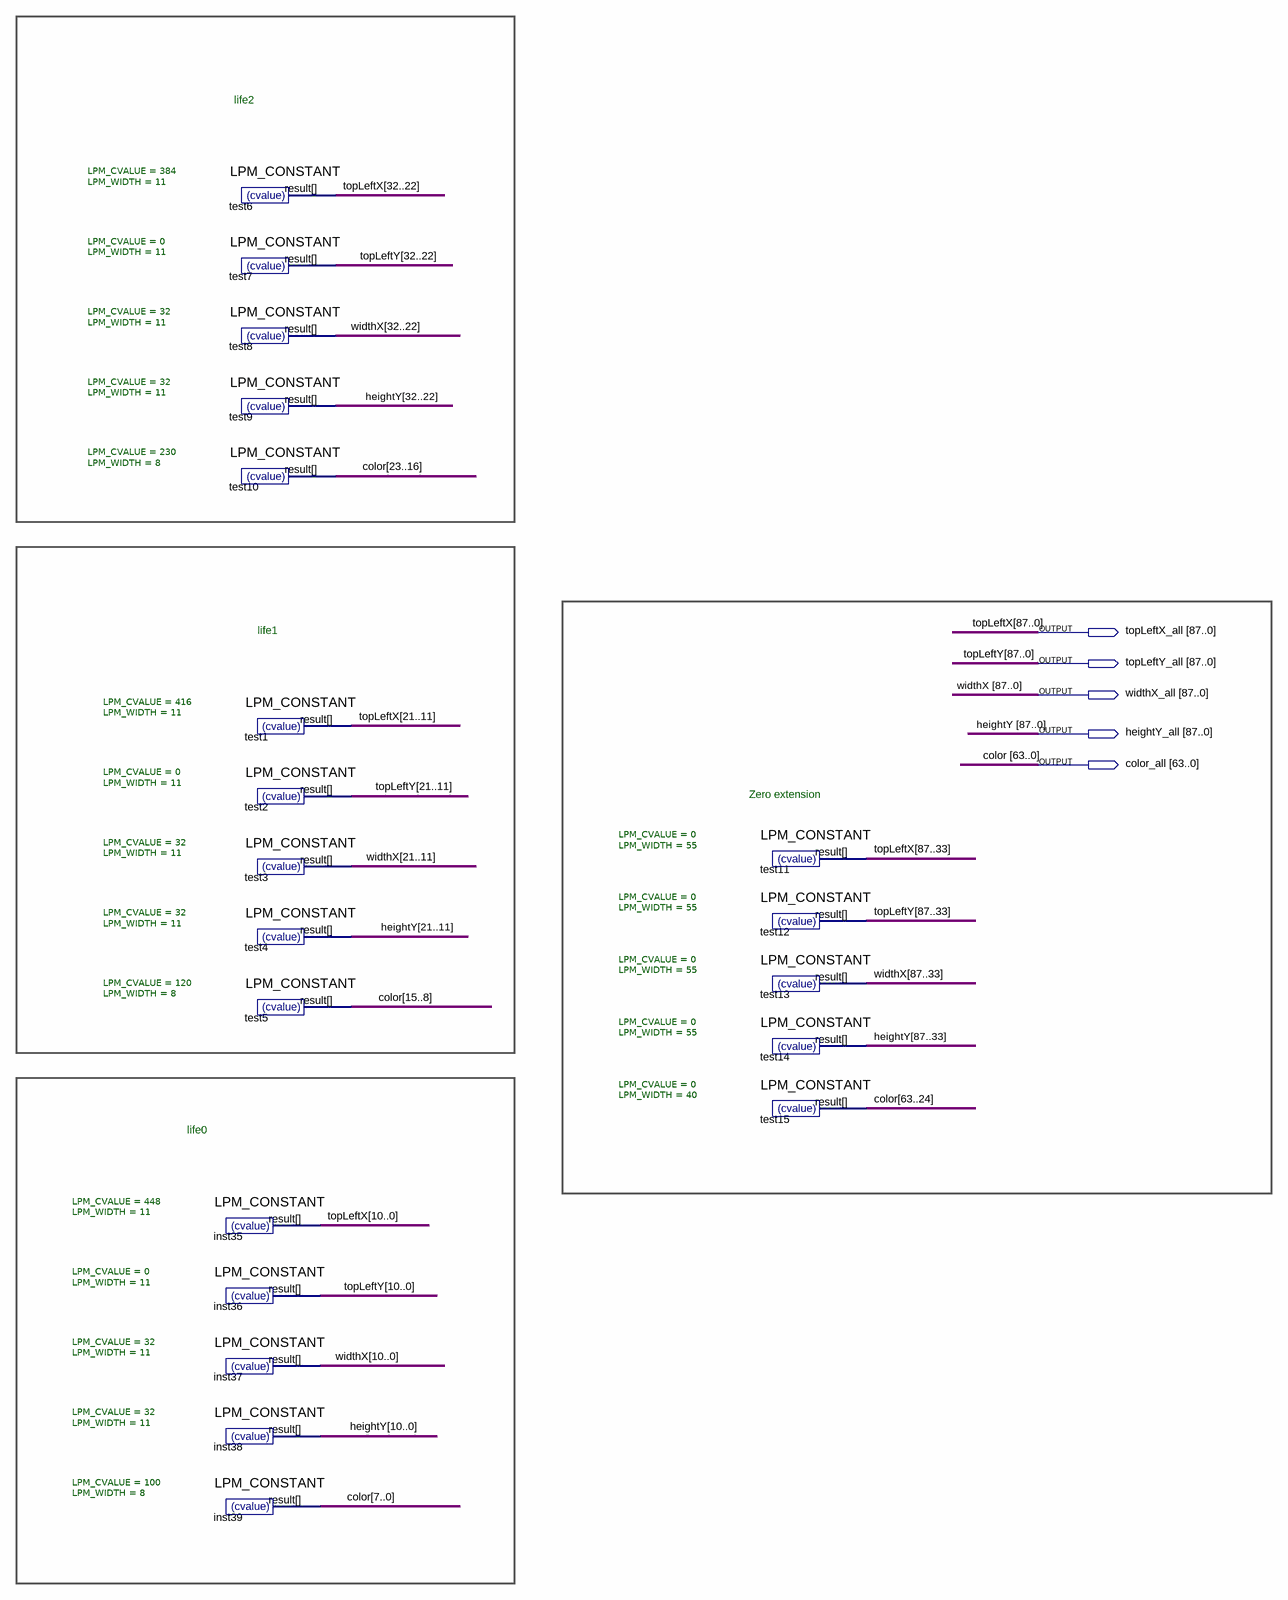
[diagram p0: schematic sheet]
// Quartus schematic LivesValues.bdf as structural Verilog: 20 symbols, 5 pins
module LivesValues (
  output [87:0] topLeftX_all,
  output [87:0] topLeftY_all,
  output [87:0] widthX_all,
  output [87:0] heightY_all,
  output [63:0] color_all
);

  LPM_CONSTANT #(.LPM_CVALUE(384), .LPM_WIDTH(11)) test6 (.result(topLeftX_all[32:22]));
  LPM_CONSTANT #(.LPM_CVALUE(0), .LPM_WIDTH(11)) test7 (.result(topLeftY_all[32:22]));
  LPM_CONSTANT #(.LPM_CVALUE(32), .LPM_WIDTH(11)) test8 (.result(widthX_all[32:22]));
  LPM_CONSTANT #(.LPM_CVALUE(32), .LPM_WIDTH(11)) test9 (.result(heightY_all[32:22]));
  LPM_CONSTANT #(.LPM_CVALUE(230), .LPM_WIDTH(8)) test10 (.result(color_all[23:16]));
  LPM_CONSTANT #(.LPM_CVALUE(448), .LPM_WIDTH(11)) inst35 (.result(topLeftX_all[10:0]));
  LPM_CONSTANT #(.LPM_CVALUE(0), .LPM_WIDTH(11)) inst36 (.result(topLeftY_all[10:0]));
  LPM_CONSTANT #(.LPM_CVALUE(32), .LPM_WIDTH(11)) inst37 (.result(widthX_all[10:0]));
  LPM_CONSTANT #(.LPM_CVALUE(32), .LPM_WIDTH(11)) inst38 (.result(heightY_all[10:0]));
  LPM_CONSTANT #(.LPM_CVALUE(100), .LPM_WIDTH(8)) inst39 (.result(color_all[7:0]));
  LPM_CONSTANT #(.LPM_CVALUE(416), .LPM_WIDTH(11)) test1 (.result(topLeftX_all[21:11]));
  LPM_CONSTANT #(.LPM_CVALUE(0), .LPM_WIDTH(11)) test2 (.result(topLeftY_all[21:11]));
  LPM_CONSTANT #(.LPM_CVALUE(32), .LPM_WIDTH(11)) test3 (.result(widthX_all[21:11]));
  LPM_CONSTANT #(.LPM_CVALUE(32), .LPM_WIDTH(11)) test4 (.result(heightY_all[21:11]));
  LPM_CONSTANT #(.LPM_CVALUE(120), .LPM_WIDTH(8)) test5 (.result(color_all[15:8]));
  LPM_CONSTANT #(.LPM_CVALUE(0), .LPM_WIDTH(55)) test11 (.result(topLeftX_all[87:33]));
  LPM_CONSTANT #(.LPM_CVALUE(0), .LPM_WIDTH(55)) test12 (.result(topLeftY_all[87:33]));
  LPM_CONSTANT #(.LPM_CVALUE(0), .LPM_WIDTH(55)) test13 (.result(widthX_all[87:33]));
  LPM_CONSTANT #(.LPM_CVALUE(0), .LPM_WIDTH(55)) test14 (.result(heightY_all[87:33]));
  LPM_CONSTANT #(.LPM_CVALUE(0), .LPM_WIDTH(40)) test15 (.result(color_all[63:24]));

  // Other names for the same wires on the sheet: color[63:0] = color_all; heightY[87:0] = heightY_all;
  //   topLeftX[87:0] = topLeftX_all; topLeftY[87:0] = topLeftY_all; widthX[87:0] = widthX_all

  // Notes on the sheet:
  //   life2
  //   life1
  //   Zero extension
  //   life0
endmodule
